# EAGLE design House_LED_Replace_WS5050 (EAGLE 9.6.2)
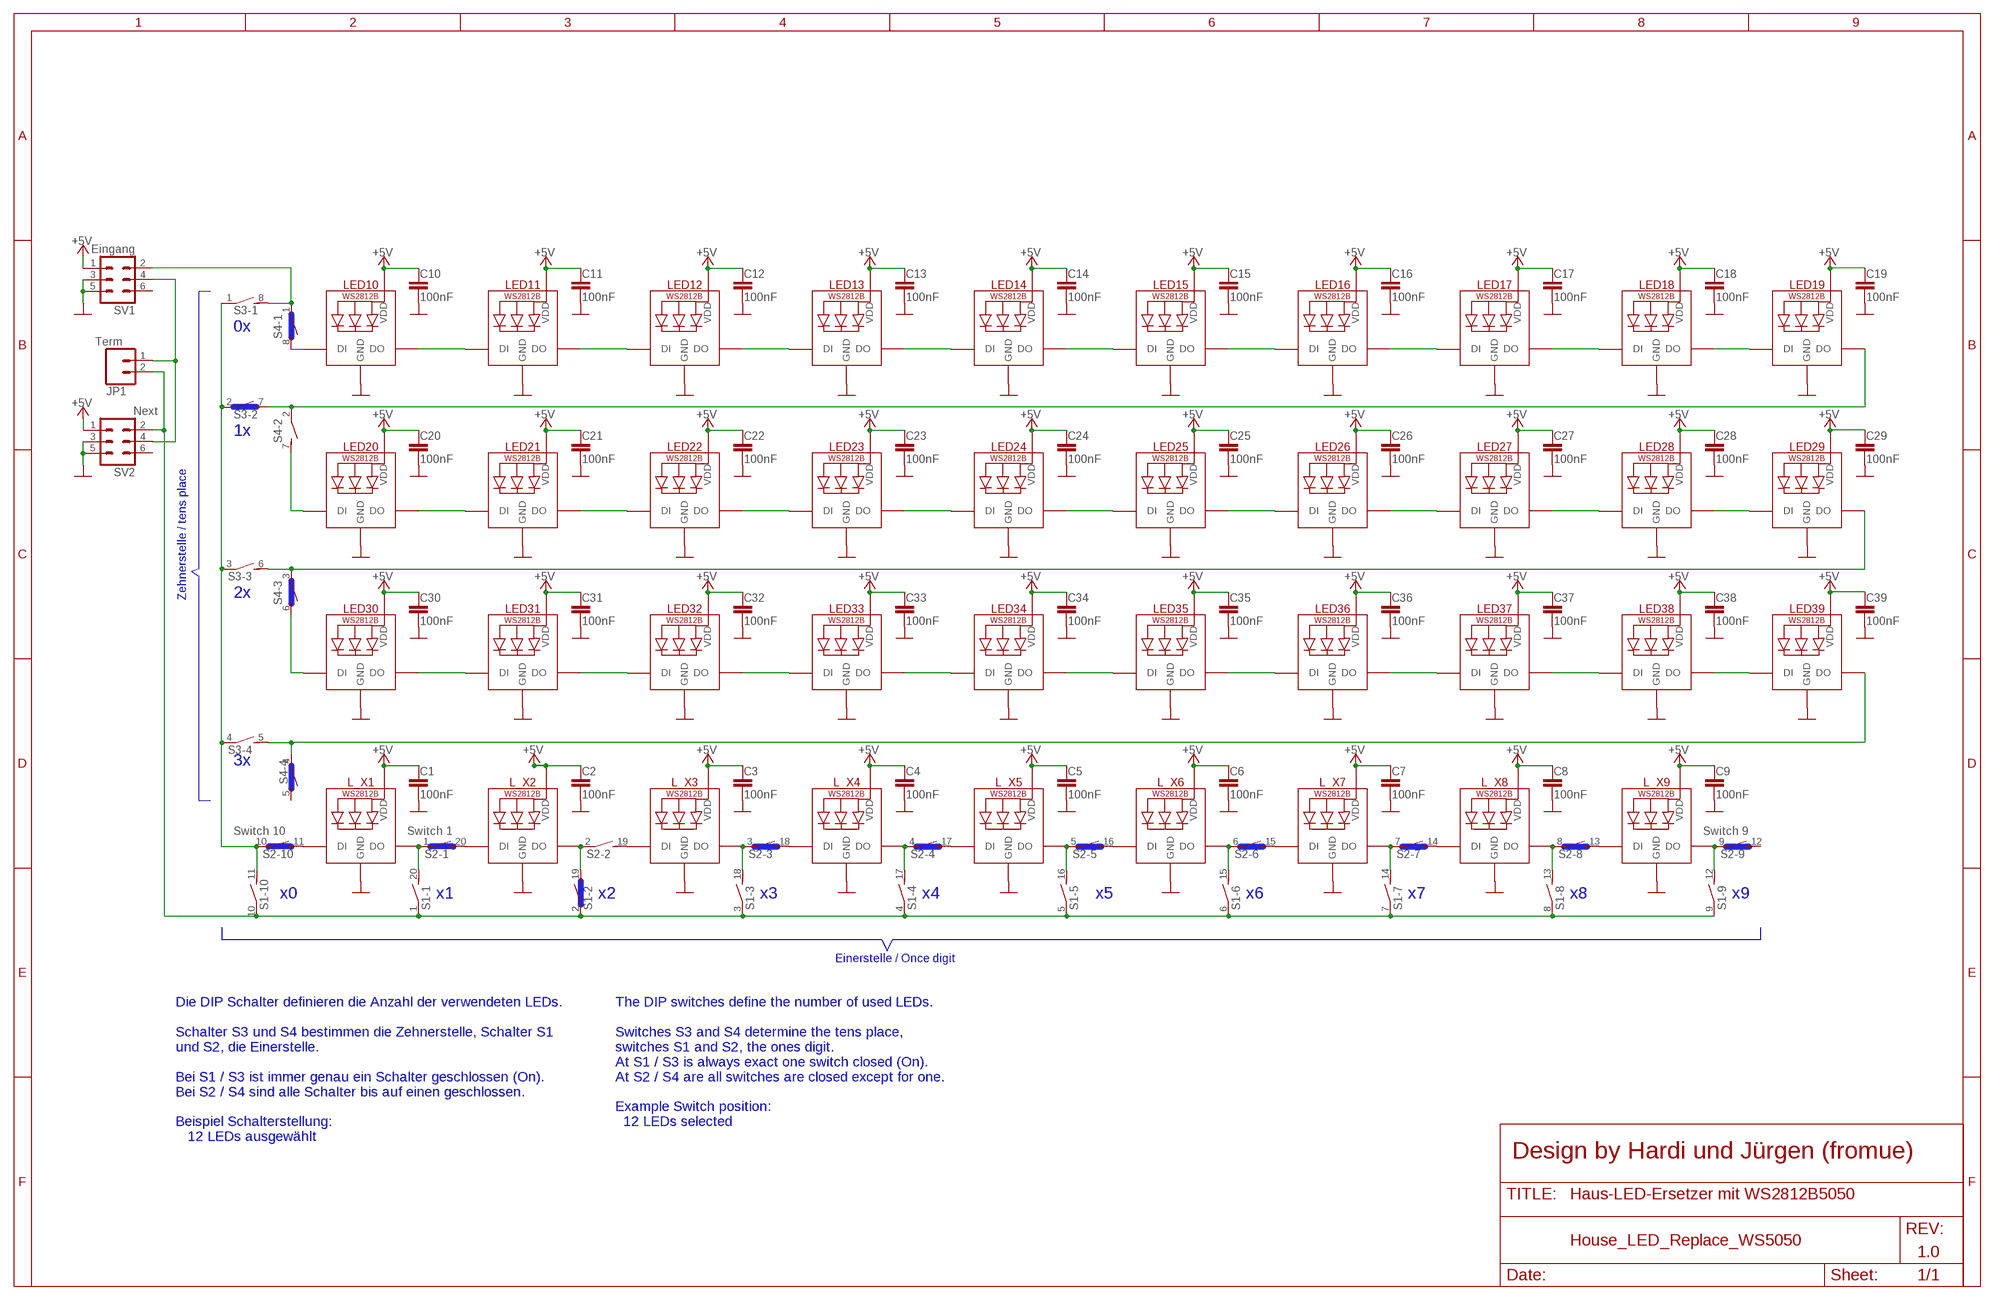
[diagram p0: schematic, sheet 1]
FRAME1 (FRAME_B_L): DATE: >LAST_DATE_TIME.; HARDI: Design by Hardi und Jürgen (fromue)

## Parts
C1  100nF  C-EUC0603  [C0603]
C2  100nF  C-EUC0603  [C0603]
C3  100nF  C-EUC0603  [C0603]
C4  100nF  C-EUC0603  [C0603]
C5  100nF  C-EUC0603  [C0603]
C6  100nF  C-EUC0603  [C0603]
C7  100nF  C-EUC0603  [C0603]
C8  100nF  C-EUC0603  [C0603]
C9  100nF  C-EUC0603  [C0603]
C10  100nF  C-EUC0603  [C0603]
C11  100nF  C-EUC0603  [C0603]
C12  100nF  C-EUC0603  [C0603]
C13  100nF  C-EUC0603  [C0603]
C14  100nF  C-EUC0603  [C0603]
C15  100nF  C-EUC0603  [C0603]
C16  100nF  C-EUC0603  [C0603]
C17  100nF  C-EUC0603  [C0603]
C18  100nF  C-EUC0603  [C0603]
C19  100nF  C-EUC0603  [C0603]
C20  100nF  C-EUC0603  [C0603]
C21  100nF  C-EUC0603  [C0603]
C22  100nF  C-EUC0603  [C0603]
C23  100nF  C-EUC0603  [C0603]
C24  100nF  C-EUC0603  [C0603]
C25  100nF  C-EUC0603  [C0603]
C26  100nF  C-EUC0603  [C0603]
C27  100nF  C-EUC0603  [C0603]
C28  100nF  C-EUC0603  [C0603]
C29  100nF  C-EUC0603  [C0603]
C30  100nF  C-EUC0603  [C0603]
C31  100nF  C-EUC0603  [C0603]
C32  100nF  C-EUC0603  [C0603]
C33  100nF  C-EUC0603  [C0603]
C34  100nF  C-EUC0603  [C0603]
C35  100nF  C-EUC0603  [C0603]
C36  100nF  C-EUC0603  [C0603]
C37  100nF  C-EUC0603  [C0603]
C38  100nF  C-EUC0603  [C0603]
C39  100nF  C-EUC0603  [C0603]
JP1  Term  M02PTH  [1X02]
L_X1  WS2812B5050  [WS2812B]
L_X2  WS2812B5050  [WS2812B]
L_X3  WS2812B5050  [WS2812B]
L_X4  WS2812B5050  [WS2812B]
L_X5  WS2812B5050  [WS2812B]
L_X6  WS2812B5050  [WS2812B]
L_X7  WS2812B5050  [WS2812B]
L_X8  WS2812B5050  [WS2812B]
L_X9  WS2812B5050  [WS2812B]
LED10  WS2812B5050  [WS2812B]
LED11  WS2812B5050  [WS2812B]
LED12  WS2812B5050  [WS2812B]
LED13  WS2812B5050  [WS2812B]
LED14  WS2812B5050  [WS2812B]
LED15  WS2812B5050  [WS2812B]
LED16  WS2812B5050  [WS2812B]
LED17  WS2812B5050  [WS2812B]
LED18  WS2812B5050  [WS2812B]
LED19  WS2812B5050  [WS2812B]
LED20  WS2812B5050  [WS2812B]
LED21  WS2812B5050  [WS2812B]
LED22  WS2812B5050  [WS2812B]
LED23  WS2812B5050  [WS2812B]
LED24  WS2812B5050  [WS2812B]
LED25  WS2812B5050  [WS2812B]
LED26  WS2812B5050  [WS2812B]
LED27  WS2812B5050  [WS2812B]
LED28  WS2812B5050  [WS2812B]
LED29  WS2812B5050  [WS2812B]
LED30  WS2812B5050  [WS2812B]
LED31  WS2812B5050  [WS2812B]
LED32  WS2812B5050  [WS2812B]
LED33  WS2812B5050  [WS2812B]
LED34  WS2812B5050  [WS2812B]
LED35  WS2812B5050  [WS2812B]
LED36  WS2812B5050  [WS2812B]
LED37  WS2812B5050  [WS2812B]
LED38  WS2812B5050  [WS2812B]
LED39  WS2812B5050  [WS2812B]
S1  DIP10SB  [DIP10SB]
S2  DIP10SB  [DIP10SB]
S3  DIP04S  [DIP04S]
S4  DIP04S  [DIP04S]
SV1  Eingang  ML6  [ML6]
SV2  Next  ML6  [ML6]

## Nets
+5V: C1.1 C2.1 C3.1 C4.1 C5.1 C6.1 C7.1 C8.1 C9.1 C10.1 C11.1 C12.1 C13.1 C14.1 C15.1 C16.1 C17.1 C18.1 C19.1 C20.1 C21.1 C22.1 C23.1 C24.1 C25.1 C26.1 C27.1 C28.1 C29.1 C30.1 C31.1 C32.1 C33.1 C34.1 C35.1 C36.1 C37.1 C38.1 C39.1 L_X1.1-5V(VDD) L_X2.1-5V(VDD) L_X3.1-5V(VDD) L_X4.1-5V(VDD) L_X5.1-5V(VDD) L_X6.1-5V(VDD) L_X7.1-5V(VDD) L_X8.1-5V(VDD) L_X9.1-5V(VDD) LED10.1-5V(VDD) LED11.1-5V(VDD) LED12.1-5V(VDD) LED13.1-5V(VDD) LED14.1-5V(VDD) LED15.1-5V(VDD) LED16.1-5V(VDD) LED17.1-5V(VDD) LED18.1-5V(VDD) LED19.1-5V(VDD) LED20.1-5V(VDD) LED21.1-5V(VDD) LED22.1-5V(VDD) LED23.1-5V(VDD) LED24.1-5V(VDD) LED25.1-5V(VDD) LED26.1-5V(VDD) LED27.1-5V(VDD) LED28.1-5V(VDD) LED29.1-5V(VDD) LED30.1-5V(VDD) LED31.1-5V(VDD) LED32.1-5V(VDD) LED33.1-5V(VDD) LED34.1-5V(VDD) LED35.1-5V(VDD) LED36.1-5V(VDD) LED37.1-5V(VDD) LED38.1-5V(VDD) LED39.1-5V(VDD) SV1.1 SV2.1
GND: C1.2 C2.2 C3.2 C4.2 C5.2 C6.2 C7.2 C8.2 C9.2 C10.2 C11.2 C12.2 C13.2 C14.2 C15.2 C16.2 C17.2 C18.2 C19.2 C20.2 C21.2 C22.2 C23.2 C24.2 C25.2 C26.2 C27.2 C28.2 C29.2 C30.2 C31.2 C32.2 C33.2 C34.2 C35.2 C36.2 C37.2 C38.2 C39.2 L_X1.3-GND(GND) L_X2.3-GND(GND) L_X3.3-GND(GND) L_X4.3-GND(GND) L_X5.3-GND(GND) L_X6.3-GND(GND) L_X7.3-GND(GND) L_X8.3-GND(GND) L_X9.3-GND(GND) LED10.3-GND(GND) LED11.3-GND(GND) LED12.3-GND(GND) LED13.3-GND(GND) LED14.3-GND(GND) LED15.3-GND(GND) LED16.3-GND(GND) LED17.3-GND(GND) LED18.3-GND(GND) LED19.3-GND(GND) LED20.3-GND(GND) LED21.3-GND(GND) LED22.3-GND(GND) LED23.3-GND(GND) LED24.3-GND(GND) LED25.3-GND(GND) LED26.3-GND(GND) LED27.3-GND(GND) LED28.3-GND(GND) LED29.3-GND(GND) LED30.3-GND(GND) LED31.3-GND(GND) LED32.3-GND(GND) LED33.3-GND(GND) LED34.3-GND(GND) LED35.3-GND(GND) LED36.3-GND(GND) LED37.3-GND(GND) LED38.3-GND(GND) LED39.3-GND(GND) SV1.3 SV1.5 SV2.3 SV2.5
N$1: JP1.2 S1.1 S1.2 S1.3 S1.4 S1.5 S1.6 S1.7 S1.8 S1.9 S1.10 SV2.2
N$2: L_X1.2-DOUT(DO) S1.20 S2.1
N$3: L_X2.4-DIN(DI) S2.20
N$4: L_X2.2-DOUT(DO) S1.19 S2.2
N$5: L_X3.4-DIN(DI) S2.19
N$6: L_X3.2-DOUT(DO) S1.18 S2.3
N$7: L_X4.4-DIN(DI) S2.18
N$8: L_X4.2-DOUT(DO) S1.17 S2.4
N$9: LED10.2-DOUT(DO) LED11.4-DIN(DI)
N$10: LED11.2-DOUT(DO) LED12.4-DIN(DI)
N$11: LED12.2-DOUT(DO) LED13.4-DIN(DI)
N$12: LED13.2-DOUT(DO) LED14.4-DIN(DI)
N$13: LED14.2-DOUT(DO) LED15.4-DIN(DI)
N$14: LED15.2-DOUT(DO) LED16.4-DIN(DI)
N$15: LED16.2-DOUT(DO) LED17.4-DIN(DI)
N$16: LED17.2-DOUT(DO) LED18.4-DIN(DI)
N$17: LED18.2-DOUT(DO) LED19.4-DIN(DI)
N$18: LED30.2-DOUT(DO) LED31.4-DIN(DI)
N$19: LED20.2-DOUT(DO) LED21.4-DIN(DI)
N$20: LED21.2-DOUT(DO) LED22.4-DIN(DI)
N$21: LED22.2-DOUT(DO) LED23.4-DIN(DI)
N$22: LED23.2-DOUT(DO) LED24.4-DIN(DI)
N$23: LED24.2-DOUT(DO) LED25.4-DIN(DI)
N$24: LED25.2-DOUT(DO) LED26.4-DIN(DI)
N$25: LED26.2-DOUT(DO) LED27.4-DIN(DI)
N$26: LED27.2-DOUT(DO) LED28.4-DIN(DI)
N$27: LED28.2-DOUT(DO) LED29.4-DIN(DI)
N$28: LED31.2-DOUT(DO) LED32.4-DIN(DI)
N$29: LED32.2-DOUT(DO) LED33.4-DIN(DI)
N$30: LED33.2-DOUT(DO) LED34.4-DIN(DI)
N$31: LED34.2-DOUT(DO) LED35.4-DIN(DI)
N$32: LED35.2-DOUT(DO) LED36.4-DIN(DI)
N$33: LED36.2-DOUT(DO) LED37.4-DIN(DI)
N$34: LED37.2-DOUT(DO) LED38.4-DIN(DI)
N$35: LED38.2-DOUT(DO) LED39.4-DIN(DI)
N$36: L_X5.4-DIN(DI) S2.17
N$37: L_X5.2-DOUT(DO) S1.16 S2.5
N$38: LED19.2-DOUT(DO) S3.7 S4.2
N$39: LED20.4-DIN(DI) S4.7
N$40: L_X6.4-DIN(DI) S2.16
N$41: LED30.4-DIN(DI) S4.6
N$42: LED39.2-DOUT(DO) S3.5 S4.4
N$43: L_X6.2-DOUT(DO) S1.15 S2.6
N$44: L_X7.4-DIN(DI) S2.15
N$45: L_X7.2-DOUT(DO) S1.14 S2.7
N$46: L_X8.4-DIN(DI) S2.14
N$47: L_X8.2-DOUT(DO) S1.13 S2.8
N$48: LED10.4-DIN(DI) S4.8
N$49: S3.8 S4.1 SV1.2
N$50: S1.11 S2.10 S3.1 S3.2 S3.3 S3.4
N$51: L_X9.4-DIN(DI) S2.13
N$52: L_X9.2-DOUT(DO) S1.12 S2.9
N$53: L_X1.4-DIN(DI) S2.11
N$54: JP1.1 SV1.4 SV2.4
N$61: LED29.2-DOUT(DO) S3.6 S4.3
Unconnected: S2.12 S4.5 SV1.6 SV2.6

## Buses
B$1

## Notes on the sheet
- 0x
- 1x
- Zehnerstelle / tens place | 2x
- 3x
- Switch 10 | Switch 1 | Switch 9
- x0 | x1 | x2 | x3 | x4 | x5 | x6 | x7 | x8 | x9
- Einerstelle / Once digit
- Die DIP Schalter definieren die Anzahl der verwendeten LEDs. 
  
  Schalter S3 und S4 bestimmen die Zehnerstelle, Schalter S1 
  und S2, die Einerstelle. 
  
  Bei S1 / S3 ist immer genau ein Schalter geschlossen (On).
  Bei S2 / S4 sind alle Schalter bis auf einen geschlossen.
  
  Beispiel Schalterstellung:
     12 LEDs ausgewählt
- The DIP switches define the number of used LEDs. 
  
  Switches S3 and S4 determine the tens place, 
  switches S1 and S2, the ones digit.
  At S1 / S3 is always exact one switch closed (On).
  At S2 / S4 are all switches are closed except for one.
  
  Example Switch position:
    12 LEDs selected
- Haus-LED-Ersetzer mit WS2812B5050
- 1.0

## Library data of the parts
C1-C39 = rcl:C-EU: CAPACITOR, European symbol
JP1 = SparkFun-Connectors:M02: Standard 2-pin 0.1" header. Use with - straight break away headers ( PRT-00116) - right angle break away headers (PRT-00553) - swiss pins (PRT-00743) - machine pins (PRT-00117) - female headers (PRT-00115) Molex polarized connector foot print use with: PRT-08233 with associated crimp pins and housings. 2.54_SCREWTERM for use with PRT-10571. 3.5mm Screw Terminal footprints for PRT-08084 5mm Screw Terminal footprints for use with PRT-08432
L_X1-L_X9 LED10-LED39 = adafruit:WS2812B
S1 S2 = switch-dil:DIP10SB: DIL/CODE SWITCH; OC_FARNELL: unknown; OC_NEWARK: unknown
S3 S4 = switch-dil:DIP04S: DIL/CODE SWITCH; OC_FARNELL: unknown; OC_NEWARK: unknown
SV1 SV2 = Arduino_fuer_LEDs_DCC_2:ML6: HARTING; OC_FARNELL: unknown; OC_NEWARK: unknown

## Board
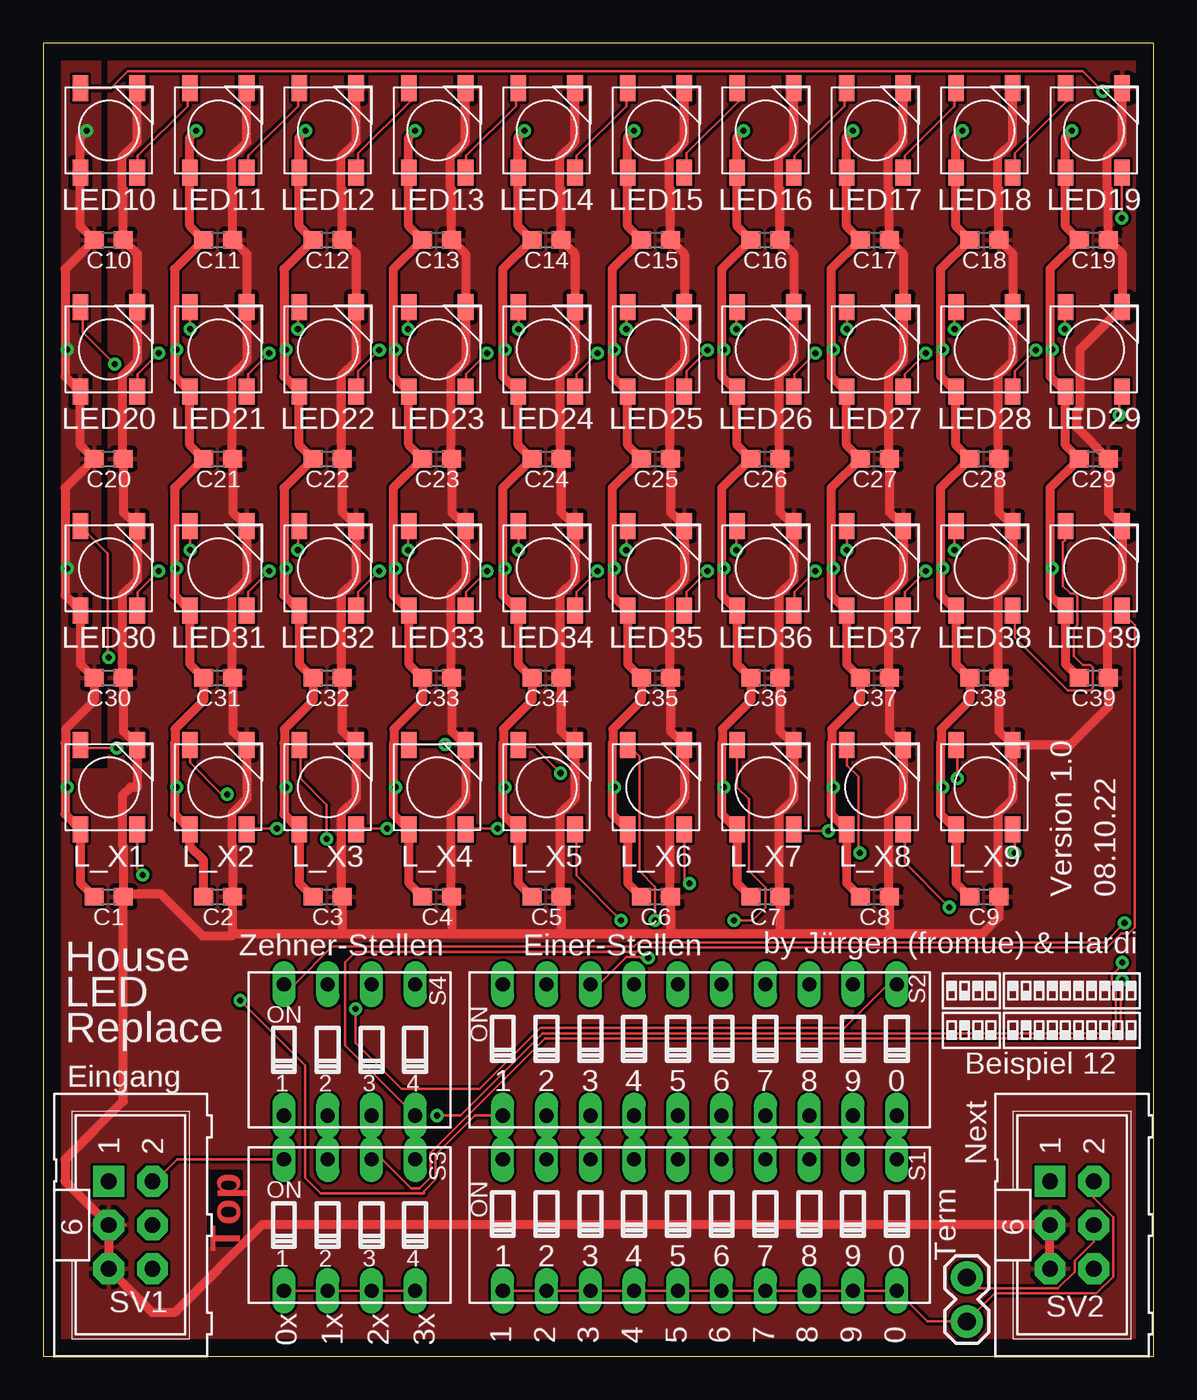
[diagram p1: board, top side]
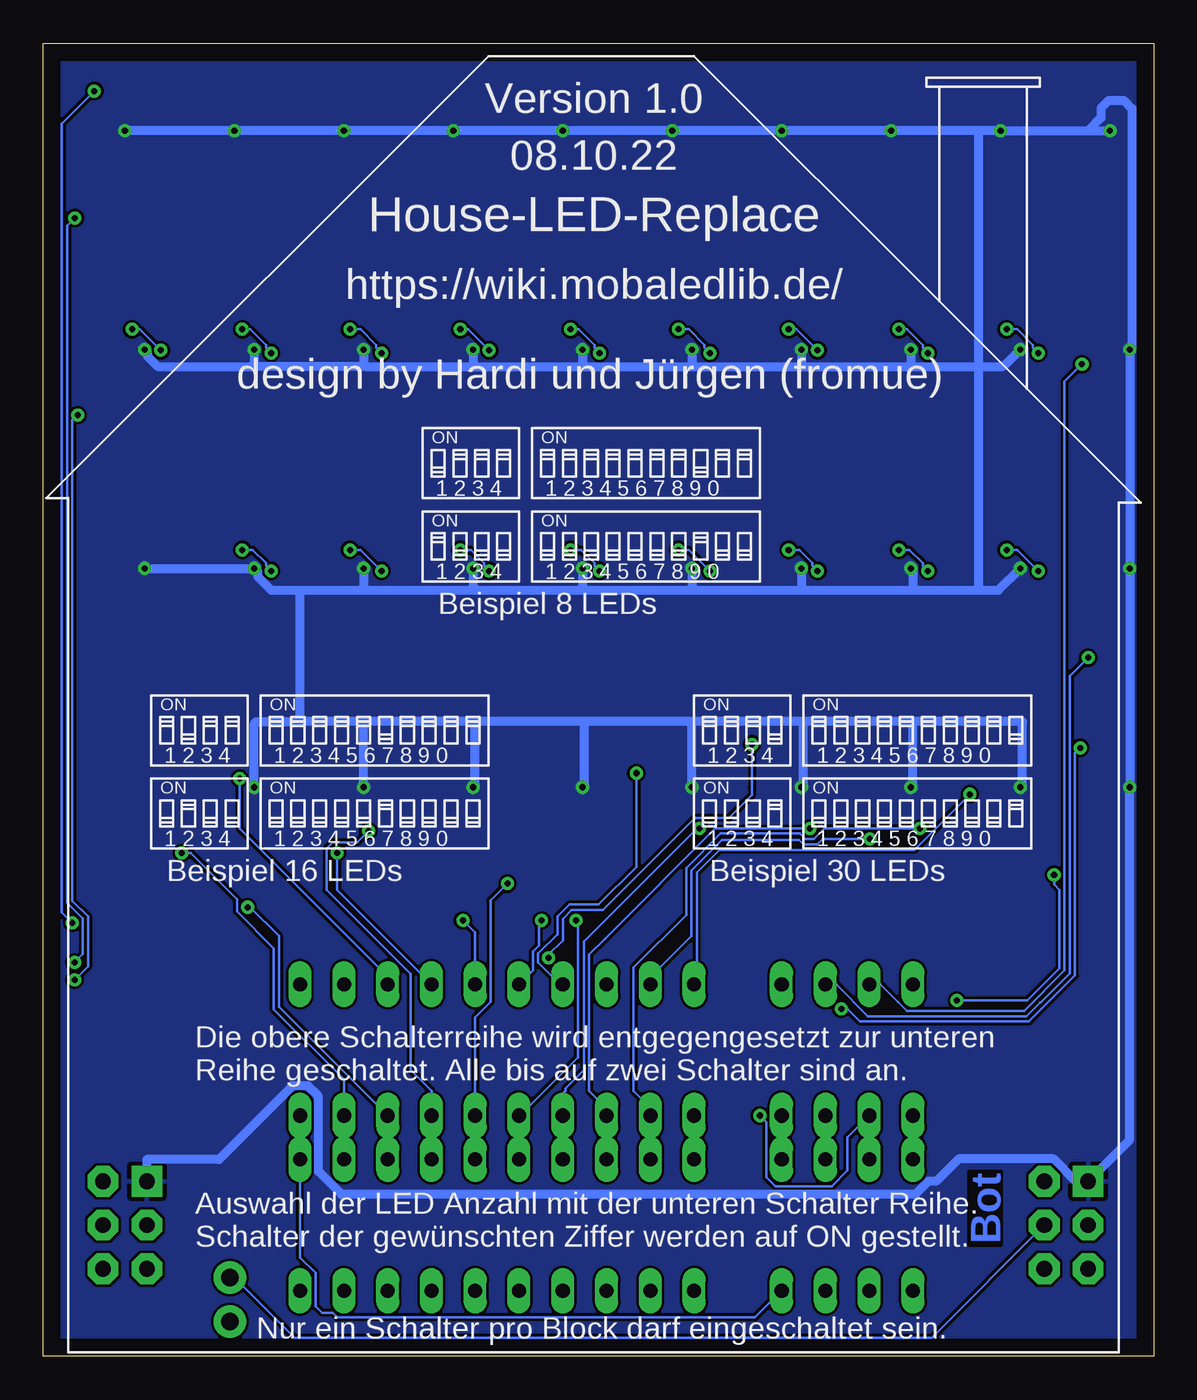
[diagram p2: board, bottom side, seen from below]

Size 64.44 x 76.19 mm. Coordinates in mm from the lower left corner, seen from the top.
Outline: 0,0 64.44,0 64.44,76.19 0,76.19 0,0
Copper layers (1*16): Top 0.035mm / dielectric 1.5mm / Bottom 0.035mm
Design rules "default *": minimum track width 6mil, minimum drill 0.35mm, track to track 6mil, track to pad 6mil, pad to pad 6mil, via to via 6mil, smd to smd 6mil, copper to edge 40mil, drill to drill 6mil, minimum pad ring 10mil, minimum via ring 8mil, stop-mask expansion 4mil, vias tented up to drill 0.5mm, thermal gap 10mil

### Footprints (pad centres in the part's own frame; a part is rotated, then mirrored left to right if it is on the bottom)
C0603 = smd 1.1 x 1: 1 -0.85,0; 2 0.85,0
1X02 = drill 1.016 pad 1.88: 1 0,0; 2 2.54,0
WS2812B = smd 1.5 x 0.9: 1-5V 2.45,-1.65; 2-DOUT 2.45,1.65; 3-GND -2.45,1.65; 4-DIN -2.45,-1.65
DIP10SB = drill 0.813 long: 1 -11.43,-3.81; 2 -8.89,-3.81; 3 -6.35,-3.81; 4 -3.81,-3.81; 5 -1.27,-3.81; 6 1.27,-3.81; 7 3.81,-3.81; 8 6.35,-3.81; 9 8.89,-3.81; 10 11.43,-3.81; 11 11.43,3.81; 12 8.89,3.81; 13 6.35,3.81; 14 3.81,3.81; 15 1.27,3.81; 16 -1.27,3.81; 17 -3.81,3.81; 18 -6.35,3.81; 19 -8.89,3.81; 20 -11.43,3.81
DIP04S = drill 0.813 long: 1 -3.81,-3.81; 2 -1.27,-3.81; 3 1.27,-3.81; 4 3.81,-3.81; 5 3.81,3.81; 6 1.27,3.81; 7 -1.27,3.81; 8 -3.81,3.81
ML6 = drill 0.914 pad 1.778 square: 1 -2.54,-1.27 | drill 0.914 pad 1.778 octagon: 2 -2.54,1.27; 3 0,-1.27; 4 0,1.27; 5 2.54,-1.27; 6 2.54,1.27

### Placement (x,y rotation side)
C1  3.81,26.67 0 top
C2  10.16,26.67 0 top
C3  16.51,26.67 0 top
C4  22.86,26.67 0 top
C5  29.21,26.67 0 top
C6  35.56,26.67 0 top
C7  41.91,26.67 0 top
C8  48.26,26.67 0 top
C9  54.61,26.67 0 top
C10  3.81,64.77 0 top
C11  10.16,64.77 0 top
C12  16.51,64.77 0 top
C13  22.86,64.77 0 top
C14  29.21,64.77 0 top
C15  35.56,64.77 0 top
C16  41.91,64.77 0 top
C17  48.26,64.77 0 top
C18  54.61,64.77 0 top
C19  60.96,64.77 0 top
C20  3.81,52.07 0 top
C21  10.16,52.07 0 top
C22  16.51,52.07 0 top
C23  22.86,52.07 0 top
C24  29.21,52.07 0 top
C25  35.56,52.07 0 top
C26  41.91,52.07 0 top
C27  48.26,52.07 0 top
C28  54.61,52.07 0 top
C29  60.96,52.07 0 top
C30  3.81,39.37 0 top
C31  10.16,39.37 0 top
C32  16.51,39.37 0 top
C33  22.86,39.37 0 top
C34  29.21,39.37 0 top
C35  35.56,39.37 0 top
C36  41.91,39.37 0 top
C37  48.26,39.37 0 top
C38  54.61,39.37 0 top
C39  60.96,39.37 0 top
JP1  53.59,4.57 270 top
L_X1  3.81,33.02 270 top
L_X2  10.16,33.02 270 top
L_X3  16.51,33.02 270 top
L_X4  22.86,33.02 270 top
L_X5  29.21,33.02 270 top
L_X6  35.56,33.02 270 top
L_X7  41.91,33.02 270 top
L_X8  48.26,33.02 270 top
L_X9  54.61,33.02 270 top
LED10  3.81,71.12 270 top
LED11  10.16,71.12 270 top
LED12  16.51,71.12 270 top
LED13  22.86,71.12 270 top
LED14  29.21,71.12 270 top
LED15  35.56,71.12 270 top
LED16  41.91,71.12 270 top
LED17  48.26,71.12 270 top
LED18  54.61,71.12 270 top
LED19  60.96,71.12 270 top
LED20  3.81,58.42 270 top
LED21  10.16,58.42 270 top
LED22  16.51,58.42 270 top
LED23  22.86,58.42 270 top
LED24  29.21,58.42 270 top
LED25  35.56,58.42 270 top
LED26  41.91,58.42 270 top
LED27  48.26,58.42 270 top
LED28  54.61,58.42 270 top
LED29  60.96,58.42 270 top
LED30  3.81,45.72 270 top
LED31  10.16,45.72 270 top
LED32  16.51,45.72 270 top
LED33  22.86,45.72 270 top
LED34  29.21,45.72 270 top
LED35  35.56,45.72 270 top
LED36  41.91,45.72 270 top
LED37  48.26,45.72 270 top
LED38  54.61,45.72 270 top
LED39  60.96,45.72 270 top
S1  38.1,7.62 0 top
S2  38.1,17.78 0 top
S3  17.78,7.62 0 top
S4  17.78,17.78 0 top
SV1  5.08,7.62 270 top
SV2  59.69,7.62 270 top

### Tracks (layer width: path | path; a pad name or v marks a point on that pad's centre or on a via)
+5V  (via drill 0.35)
  Top 0.508: v2.54,71.12 2.16,70.74 LED10.1-5V 2.16,65.57 C10.1 1.27,63.08 1.27,58.42 | 1.27,58.42 1.27,56.86 LED20.1-5V 2.16,52.87 C20.1 1.27,50.38 1.27,45.72 | 1.27,58.42 v1.39,58.42 | 1.27,45.72 1.27,44.16 LED30.1-5V 2.16,40.17 C30.1 2.96,38.05 1.3,36.39 1.3,35.59 1.27,35.56 1.27,33.02 | 1.27,45.72 v1.39,45.72 | 1.27,33.02 1.27,31.46 L_X1.1-5V 2.16,27.47 C1.1 | 1.27,33.02 v1.39,33.02 | v34.29,71.12 33.91,70.74 LED15.1-5V 33.91,65.57 C15.1 33.02,63.08 33.02,58.42 | 33.02,58.42 33.02,56.86 LED25.1-5V 33.91,52.87 C25.1 33.02,50.38 33.02,45.72 | 33.02,58.42 v33.14,58.42 | 33.02,45.72 33.02,44.16 LED35.1-5V 33.91,40.17 C35.1 34.71,38.05 33.05,36.39 33.05,35.59 33.02,35.56 33.02,33.02 | 33.02,45.72 v33.14,45.72 | 33.02,33.02 33.02,31.46 L_X6.1-5V 33.91,27.47 C6.1 | 33.02,33.02 v33.14,33.02 | v8.89,71.12 8.51,70.74 LED11.1-5V 8.51,65.57 C11.1 7.62,63.08 7.62,58.42 | 7.62,58.42 7.62,56.86 LED21.1-5V 8.51,52.87 C21.1 7.62,50.38 7.62,45.72 | 7.62,58.42 v7.74,58.42 | 7.62,45.72 7.62,44.16 LED31.1-5V 8.51,40.17 C31.1 9.31,38.05 7.65,36.39 7.65,35.59 7.62,35.56 7.62,33.02 | 7.62,45.72 v7.74,45.72 | 7.62,33.02 7.62,31.46 L_X2.1-5V 8.51,29.59 9.31,28.79 C2.1 | 7.62,33.02 v7.74,33.02 | v15.24,71.12 14.86,70.74 LED12.1-5V 14.86,65.57 C12.1 13.97,63.08 13.97,58.42 | 13.97,58.42 13.97,56.86 LED22.1-5V 14.86,52.87 C22.1 13.97,50.38 13.97,45.72 | 13.97,58.42 v14.09,58.42 | 13.97,45.72 13.97,44.16 LED32.1-5V 14.86,40.17 C32.1 15.66,38.05 14,36.39 14,35.59 13.97,35.56 13.97,33.02 | 13.97,45.72 v14.09,45.72 | 13.97,33.02 13.97,31.46 L_X3.1-5V 14.86,27.47 C3.1 | 13.97,33.02 v14.09,33.02 | v21.59,71.12 21.21,70.74 LED13.1-5V 21.21,65.57 C13.1 20.32,63.08 20.32,58.42
  Top 0.508: 20.32,58.42 20.32,56.86 LED23.1-5V 21.21,52.87 C23.1 20.32,50.38 20.32,45.72 | 20.32,58.42 v20.44,58.42 | 20.32,45.72 20.32,44.16 LED33.1-5V 21.21,40.17 C33.1 22.01,38.05 20.35,36.39 20.35,35.59 20.32,35.56 20.32,33.02 | 20.32,45.72 v20.44,45.72 | 20.32,33.02 20.32,31.46 L_X4.1-5V 21.21,27.47 C4.1 | 20.32,33.02 v20.44,33.02 | v27.94,71.12 27.56,70.74 LED14.1-5V 27.56,65.57 C14.1 26.67,63.08 26.67,58.42 | 26.67,58.42 26.67,56.86 LED24.1-5V 27.56,52.87 C24.1 26.67,50.38 26.67,45.72 | 26.67,58.42 v26.79,58.42 | 26.67,45.72 26.67,44.16 LED34.1-5V 27.56,40.17 C34.1 28.36,38.05 26.7,36.39 26.7,35.59 26.67,35.56 26.67,33.02 | 26.67,45.72 v26.79,45.72 | 26.67,33.02 26.67,31.46 L_X5.1-5V 27.56,27.47 C5.1 | 26.67,33.02 v26.79,33.02 | v40.64,71.12 40.26,70.74 LED16.1-5V 40.26,65.57 C16.1 39.37,63.08 39.37,58.42 | 39.37,58.42 39.37,56.86 LED26.1-5V 40.26,52.87 C26.1 39.37,50.38 39.37,45.72 | 39.37,58.42 v39.49,58.42 | 39.37,45.72 39.37,44.16 LED36.1-5V 40.26,40.17 C36.1 41.06,38.05 39.4,36.39 39.4,35.59 39.37,35.56 39.37,33.02 | 39.37,45.72 v39.49,45.72 | 39.37,33.02 39.37,31.46 L_X7.1-5V 40.26,27.47 C7.1 | 39.37,33.02 v39.49,33.02 | v46.99,71.12 46.61,70.74 LED17.1-5V 46.61,65.57 C17.1 45.72,63.08 45.72,58.42 | 45.72,58.42 45.72,56.86 LED27.1-5V 46.61,52.87 C27.1 45.72,50.38 45.72,45.72 | 45.72,58.42 v45.84,58.42 | 45.72,45.72 45.72,44.16 LED37.1-5V 46.61,40.17 C37.1 47.41,38.05 45.75,36.39 45.75,35.59 45.72,35.56 45.72,33.02 | 45.72,45.72 v45.84,45.72 | 45.72,33.02 45.72,31.46 L_X8.1-5V 46.61,27.47 C8.1 | 45.72,33.02 v45.84,33.02 | v53.34,71.12 52.96,70.74 LED18.1-5V 52.96,65.57 C18.1 52.07,63.08 52.07,58.42
  Top 0.508: 52.07,58.42 52.07,56.86 LED28.1-5V 52.96,52.87 C28.1 52.07,50.38 52.07,45.72 | 52.07,58.42 v52.19,58.42 | 52.07,45.72 52.07,44.16 LED38.1-5V 52.96,40.17 C38.1 53.76,38.05 52.1,36.39 52.1,35.59 52.07,35.56 52.07,33.02 | 52.07,45.72 v52.19,45.72 | 52.07,33.02 52.07,31.46 L_X9.1-5V 52.96,27.47 C9.1 | 52.07,33.02 v52.19,33.02 | v59.69,71.12 59.31,70.74 LED19.1-5V 59.31,65.57 C19.1 58.42,63.08 58.42,58.42 | 58.42,58.42 58.42,56.86 LED29.1-5V 59.31,52.87 C29.1 58.42,50.38 58.42,45.72 | 58.42,58.42 v58.54,58.42 | 58.42,45.72 58.42,44.16 LED39.1-5V 59.31,40.17 C39.1 | 58.42,45.72 v58.54,45.72
  Bottom 0.508: v7.74,58.42 8.73,57.43 10.16,57.43 | 45.72,57.43 52.07,57.43 | 45.72,57.43 39.37,57.43 | 39.37,57.43 33.02,57.43 | 33.02,57.43 26.67,57.43 | 26.67,57.43 20.32,57.43 | 20.32,57.43 13.97,57.43 | 13.97,57.43 10.16,57.43 | v14.09,58.42 14.09,57.56 13.97,57.43 | v20.44,58.42 20.44,57.56 20.32,57.43 | v26.79,58.42 26.79,57.56 26.67,57.43 | v33.14,58.42 33.14,57.56 33.02,57.43 | v39.49,58.42 39.49,57.56 39.37,57.43 | v45.84,58.42 45.84,57.56 45.72,57.43 | v52.19,58.42 52.19,57.56 52.07,57.43 | 52.07,57.43 57.78,57.43 58.39,58.04 58.39,58.27 v58.54,58.42 | v58.54,45.72 v52.19,45.72 51.99,45.52 51.99,45.24 51.2,44.45 49.53,44.45 | v7.74,45.72 9.01,44.45 10.16,44.45 | 49.53,44.45 45.72,44.45 | 45.72,44.45 39.5,44.45 | 39.5,44.45 33.02,44.45 | 33.02,44.45 26.67,44.45 | 26.67,44.45 20.32,44.45 | 20.32,44.45 13.97,44.45 | 13.97,44.45 10.16,44.45 | v14.09,45.72 13.97,45.6 13.97,44.45 | v20.44,45.72 20.44,44.57 20.32,44.45 | v26.79,45.72 26.79,44.57 26.67,44.45 | v33.14,45.72 33.14,44.57 33.02,44.45 | v39.49,45.72 39.49,44.45 39.5,44.45 | v45.84,45.72 45.84,44.57 45.72,44.45 | 10.16,44.45 10.16,57.43 | 10.16,71.12 v8.89,71.12 3.81,71.12 | 10.16,71.12 v15.24,71.12 v21.59,71.12 v27.94,71.12 v34.29,71.12 v40.64,71.12 v46.99,71.12 v53.34,71.12 v59.69,71.12 | 49.53,36.83 49.53,44.45 | v39.49,33.02 39.37,33.14 39.37,36.83 | v33.14,33.02 33.02,33.14 33.02,36.83 | v20.44,33.02 20.32,33.14 20.32,36.83 | 20.32,36.83 26.67,36.83 | 26.67,36.83 33.02,36.83 | 33.02,36.83 39.37,36.83 | 39.37,36.83 45.72,36.83 | 45.72,36.83 49.53,36.83 | v7.74,33.02 7.62,33.14 7.62,36.83 13.97,36.83 | 13.97,36.83 20.32,36.83 | v14.09,33.02 13.97,33.14 13.97,36.83
  Bottom 0.508: v26.79,33.02 26.79,36.71 26.67,36.83 | v45.84,33.02 45.84,36.71 45.72,36.83 | v52.19,33.02 52.19,36.71 52.07,36.83 49.53,36.83 | 3.81,71.12 v2.54,71.12 | 3.81,71.12 3.07,71.86 3.07,72.41 2.61,72.87 1.75,72.87 1.27,72.39 1.27,58.54 v1.39,58.42 v1.39,45.72 v1.39,33.02 1.39,12.58 SV1.1 4.52,10.16 5.81,11.46 11.32,11.46 12.62,10.16 13.07,10.16 13.83,9.4 47.13,9.4 48.46,10.73 48.46,15.07 49.09,15.7 49.97,15.7 54.24,11.43 58.42,11.43 SV2.1 | 10.16,57.43 10.16,71.12
  pour Bottom: 0,76.2 64.77,76.2 66.04,74.93 66.04,1.27 64.77,0 0,0
  pour Top: 0,76.2 3.3,76.2 3.3,34.54 0,34.54
GND
  Top 0.152: SV1.3 4.77,7.62
  Top 0.508: LED10.3-GND 5.46,70.44 4.6,69.59 4.6,67.75 4.66,67.69 C10.2 5.46,63.97 LED20.3-GND 5.46,57.74 4.6,56.89 4.6,52.13 C20.2 4.66,48.97 LED30.3-GND 5.46,45.05 4.6,44.19 4.6,39.43 C30.2 4.66,36.27 L_X1.3-GND 5.46,33.02 5.08,33.02 4.6,32.54 4.6,29.65 4.66,29.59 C1.2 | LED11.3-GND 11.81,70.44 10.95,69.59 10.95,67.75 11.01,67.69 C11.2 11.81,63.97 LED21.3-GND 11.81,57.74 10.95,56.89 10.95,52.13 C21.2 11.01,48.97 LED31.3-GND 11.81,45.05 10.95,44.19 10.95,39.43 C31.2 11.01,36.27 L_X2.3-GND 11.81,32.34 10.95,31.49 10.95,29.65 11.01,29.59 C2.2 11.01,24.55 11.05,24.51 | LED12.3-GND 18.16,70.44 17.3,69.59 17.3,67.75 17.36,67.69 C12.2 18.16,63.97 LED22.3-GND 18.16,57.74 17.3,56.89 17.3,52.13 C22.2 17.36,48.97 LED32.3-GND 18.16,45.05 17.3,44.19 17.3,39.43 C32.2 17.36,36.27 L_X3.3-GND 18.16,32.34 17.3,31.49 17.3,26.73 C3.2 17.36,24.55 17.4,24.51 | LED13.3-GND 24.51,70.44 23.65,69.59 23.65,67.75 23.71,67.69 C13.2 24.51,63.97 LED23.3-GND 24.51,57.74 23.65,56.89 23.65,52.13 C23.2 23.71,48.97 LED33.3-GND 24.51,45.05 23.65,44.19 23.65,39.43 C33.2 23.71,36.27 L_X4.3-GND 24.51,32.34 23.65,31.49 23.65,26.73 C4.2 23.71,24.6 23.62,24.51 | LED14.3-GND 30.86,70.44 30,69.59 30,67.75 30.06,67.69 C14.2 30.86,63.97 LED24.3-GND 30.86,57.74 30,56.89 30,52.13 C24.2 30.06,48.97 LED34.3-GND 30.86,45.05 30,44.19 30,39.43 C34.2 30.06,36.27 L_X5.3-GND 30.86,32.34 30,31.49 30,26.73 C5.2 30.06,24.55 30.1,24.51 | LED15.3-GND 37.21,70.44 36.35,69.59 36.35,67.75 36.41,67.69 C15.2 37.21,63.97 LED25.3-GND 37.21,57.74 36.35,56.89 36.35,52.13 C25.2 36.41,48.97 LED35.3-GND 37.21,45.05 36.35,44.19 36.35,39.43 C35.2 36.41,36.27 L_X6.3-GND 37.21,32.34 36.35,31.49 36.35,26.73 C6.2 36.41,24.55 36.45,24.51
  Top 0.508: LED16.3-GND 43.56,70.44 42.7,69.59 42.7,67.75 42.76,67.69 C16.2 43.56,63.97 LED26.3-GND 43.56,57.74 42.7,56.89 42.7,52.13 C26.2 42.76,48.97 LED36.3-GND 43.56,45.05 42.7,44.19 42.7,39.43 C36.2 42.76,36.27 L_X7.3-GND 43.56,32.34 42.7,31.49 42.7,26.73 C7.2 42.76,24.55 42.8,24.51 | LED17.3-GND 49.91,70.44 49.05,69.59 49.05,67.75 49.11,67.69 C17.2 49.91,63.97 LED27.3-GND 49.91,57.74 49.05,56.89 49.05,52.13 C27.2 49.11,48.97 LED37.3-GND 49.91,45.05 49.05,44.19 49.05,39.43 C37.2 49.11,36.27 L_X8.3-GND 49.91,32.34 49.05,31.49 49.05,26.73 C8.2 49.11,24.55 49.15,24.51 | LED18.3-GND 56.26,70.44 55.4,69.59 55.4,67.75 55.46,67.69 C18.2 56.26,63.97 LED28.3-GND 56.26,57.74 55.4,56.89 55.4,52.13 C28.2 55.46,48.97 LED38.3-GND 56.26,45.05 55.4,44.19 55.4,39.43 C38.2 55.46,36.27 L_X9.3-GND | L_X9.3-GND 56.26,32.34 55.4,31.49 55.4,26.73 C9.2 55.46,25.49 54.48,24.51 49.15,24.51 | LED19.3-GND 62.61,70.44 61.75,69.59 61.75,67.75 61.81,67.69 C19.2 62.61,63.97 LED29.3-GND 60.17,58.43 60.17,55.05 59.97,54.86 59.97,53.91 C29.2 61.81,48.97 LED39.3-GND 62.61,45.05 61.75,44.19 61.75,39.43 C39.2 61.81,37.68 59.6,35.47 L_X9.3-GND | 49.15,24.51 42.8,24.51 | 42.8,24.51 36.45,24.51 | 36.45,24.51 30.1,24.51 | 30.1,24.51 23.62,24.51 | 23.62,24.51 17.4,24.51 | 17.4,24.51 11.05,24.51 | 11.05,24.51 10.92,24.38 9.27,24.38 6.83,26.82 4.81,26.82 C1.2 | C1.2 4.66,14.82 1.27,11.43 1.27,10.16 SV1.3 SV1.5 6.35,2.54 7.62,2.54 12.7,7.62 SV2.3 SV2.5
  pour Top: 3.81,76.2 64.52,76.2 64.52,0 0,0 0,34.04 3.81,34.04
N$1
  Top 0.152: S1.1 S1.2 S1.3 S1.4 S1.5 S1.6 S1.7 S1.8 S1.9 S1.10 51.31,2.03 JP1.2 55.22,3.66 61.12,3.66 62.08,4.62 62.08,8.08 60.96,9.2 SV2.2
N$2  (via drill 0.35)
  Top 0.152: S1.20 S2.1 25.07,13.97 22.78,11.68 22.78,10.28 22.1,9.59 22.1,9.45 16.1,9.45 15.19,10.36 15.19,16.89 v11.43,20.65 | L_X1.2-DOUT 5.46,28.27 v5.79,27.94
  Bottom 0.152: v5.79,27.94 5.79,27.38 5.48,27.07 5.48,22.51 7.34,20.65 v11.43,20.65
N$3  (via drill 0.35)
  Top 0.152: v10.67,32.61 10.36,32.61 8.53,34.44 8.53,35.36 L_X2.4-DIN
  Bottom 0.152: v10.67,32.61 13.89,29.39 25.2,29.39 26.52,28.07 26.52,21.74 S2.20
N$4  (via drill 0.35)
  Top 0.152: v13.56,30.63 11.89,30.63 L_X2.2-DOUT | S1.19 29.26,11.43 29.26,13.87 S2.2
  Bottom 0.152: v13.56,30.63 19.11,30.63 19.71,30.03 20.22,30.03 20.52,30.33 25.15,30.33 27.13,28.35 27.13,25.6 30.18,22.55 30.18,15.39 29.26,14.48 29.26,14.02 S2.2
N$5  (via drill 0.35)
  Top 0.152: v16.46,30.02 16.46,32 14.94,33.53 14.94,35.36 L_X3.4-DIN
  Bottom 0.152: v16.46,30.02 19.2,30.02 19.53,29.69 20.31,29.69 20.58,29.96 25.05,29.96 26.82,28.19 26.82,27.94 26.82,24.38 29.11,22.1 29.11,21.64 S2.19
N$6  (via drill 0.35)
  Top 0.152: v19.96,30.63 18.29,30.63 L_X3.2-DOUT | S1.18 31.85,11.43 31.85,13.87 S2.3
  Bottom 0.152: v19.96,30.63 25.45,30.63 31.85,24.23 32.77,23.32 32.77,15.39 31.85,14.48 31.85,14.02 S2.3
N$7  (via drill 0.35)
  Top 0.152: v23.32,35.51 21.34,35.51 L_X4.4-DIN | S2.18 31.85,21.64 32.31,21.64 33.83,23.16 34.63,23.16 34.68,23.12 v35.11,23.12
  Bottom 0.152: v23.32,35.51 23.32,33.02 23.32,32.56 24.64,31.24 26.62,31.24 31.95,25.91 33.78,25.91 34.29,25.39 34.29,24.13 35.11,23.31 v35.11,23.12
N$8  (via drill 0.35)
  Top 0.152: v26.36,30.63 24.54,30.63 L_X4.2-DOUT | S2.4 S1.17
  Bottom 0.152: S2.4 34.29,15.24 34.14,15.39 34.14,15.54 33.07,16.61 33.07,24.08 26.52,30.63 v26.36,30.63
N$9
  Top 0.152: LED10.2-DOUT 5.49,68.73 5.49,69.65 8.38,72.54 8.38,73.46 LED11.4-DIN
N$10
  Top 0.152: LED11.2-DOUT 11.89,68.73 11.89,69.65 14.78,72.54 14.78,73.46 LED12.4-DIN
N$11
  Top 0.152: LED12.2-DOUT 18.29,68.73 18.29,69.8 21.34,72.85 21.34,73.46 LED13.4-DIN
N$12
  Top 0.152: LED13.2-DOUT 24.54,68.73 24.54,69.65 27.43,72.54 27.43,73.46 LED14.4-DIN
N$13
  Top 0.152: LED14.2-DOUT 30.94,68.73 30.94,69.65 33.83,72.54 33.83,73.46 LED15.4-DIN
N$14
  Top 0.152: LED15.2-DOUT 37.34,68.73 37.34,69.8 40.39,72.85 40.39,73.46 LED16.4-DIN
N$15
  Top 0.152: LED16.2-DOUT 43.59,68.73 43.59,69.65 46.48,72.54 46.48,73.46 LED17.4-DIN
N$16
  Top 0.152: LED17.2-DOUT 49.99,68.73 49.99,69.65 52.88,72.54 52.88,73.46 LED18.4-DIN
N$17
  Top 0.152: LED18.2-DOUT 56.39,68.73 56.39,69.8 59.44,72.85 59.44,73.46 LED19.4-DIN
N$18  (via drill 0.35)
  Top 0.152: v6.71,45.57 5.49,44.35 5.49,43.28 LED30.2-DOUT | v8.53,46.79 8.53,48.16 LED31.4-DIN
  Bottom 0.152: v6.71,45.57 7.92,46.79 v8.53,46.79
N$19  (via drill 0.35)
  Top 0.152: v6.71,58.22 5.49,57 5.49,56.08 LED20.2-DOUT | v8.53,59.59 8.53,60.81 LED21.4-DIN
  Bottom 0.152: v6.71,58.22 7.01,58.52 7.01,58.67 7.92,59.59 v8.53,59.59
N$20  (via drill 0.35)
  Top 0.152: v13.11,58.22 11.89,57 11.89,56.08 LED21.2-DOUT | v14.78,59.59 14.78,60.81 LED22.4-DIN
  Bottom 0.152: v13.11,58.22 13.41,58.52 13.41,58.67 14.33,59.59 v14.78,59.59
N$21  (via drill 0.35)
  Top 0.152: v19.51,58.37 18.29,57.15 18.29,56.08 LED22.2-DOUT | v21.18,59.59 21.18,60.81 LED23.4-DIN
  Bottom 0.152: v19.51,58.37 20.73,59.59 v21.18,59.59
N$22  (via drill 0.35)
  Top 0.152: v25.76,58.22 24.54,57 24.54,56.08 LED23.2-DOUT | v27.58,59.59 27.58,60.81 LED24.4-DIN
  Bottom 0.152: v25.76,58.22 26.06,58.52 26.06,58.67 26.98,59.59 v27.58,59.59
N$23  (via drill 0.35)
  Top 0.152: v32.16,58.22 30.94,57 30.94,56.08 LED24.2-DOUT | v33.83,59.59 33.83,60.81 LED25.4-DIN
  Bottom 0.152: v32.16,58.22 32.46,58.52 32.46,58.67 33.38,59.59 v33.83,59.59
N$24  (via drill 0.35)
  Top 0.152: v38.56,58.37 37.34,57.15 37.34,56.08 LED25.2-DOUT | v40.23,59.59 40.23,60.81 LED26.4-DIN
  Bottom 0.152: v38.56,58.37 39.78,59.59 v40.23,59.59
N$25  (via drill 0.35)
  Top 0.152: v44.81,58.22 43.59,57 43.59,56.08 LED26.2-DOUT | v46.63,59.59 46.63,60.81 LED27.4-DIN
  Bottom 0.152: v44.81,58.22 45.11,58.52 45.11,58.67 46.02,59.59 v46.63,59.59
N$26  (via drill 0.35)
  Top 0.152: v51.21,58.22 49.99,57 49.99,56.08 LED27.2-DOUT | v52.88,59.59 52.88,60.81 LED28.4-DIN
  Bottom 0.152: v51.21,58.22 51.51,58.52 51.51,58.67 52.43,59.59 v52.88,59.59
N$27  (via drill 0.35)
  Top 0.152: v57.61,58.37 56.39,57.15 56.39,56.08 LED28.2-DOUT | v59.28,59.59 59.28,60.81 LED29.4-DIN
  Bottom 0.152: v57.61,58.37 58.83,59.59 v59.28,59.59
N$28  (via drill 0.35)
  Top 0.152: v13.11,45.57 11.89,44.35 11.89,43.28 LED31.2-DOUT | v14.78,46.79 14.78,48.16 LED32.4-DIN
  Bottom 0.152: v13.11,45.57 13.41,45.87 13.41,46.02 14.17,46.79 v14.78,46.79
N$29  (via drill 0.35)
  Top 0.152: v19.51,45.57 18.29,44.35 18.29,43.28 LED32.2-DOUT | v21.18,46.79 21.18,48.16 LED33.4-DIN
  Bottom 0.152: v19.51,45.57 19.81,45.87 19.81,46.02 20.57,46.79 v21.18,46.79
N$30  (via drill 0.35)
  Top 0.152: v25.76,45.57 24.54,44.35 24.54,43.28 LED33.2-DOUT | v27.58,46.79 27.58,48.16 LED34.4-DIN
  Bottom 0.152: v25.76,45.57 26.98,46.79 v27.58,46.79
N$31  (via drill 0.35)
  Top 0.152: v32.16,45.57 30.94,44.35 30.94,43.28 LED34.2-DOUT | v33.83,46.79 33.83,48.16 LED35.4-DIN
  Bottom 0.152: v32.16,45.57 32.46,45.87 32.46,46.02 33.22,46.79 v33.83,46.79
N$32  (via drill 0.35)
  Top 0.152: v38.56,45.57 37.34,44.35 37.34,43.28 LED35.2-DOUT | v40.23,46.79 40.23,48.16 LED36.4-DIN
  Bottom 0.152: v38.56,45.57 38.86,45.87 38.86,46.02 39.62,46.79 v40.23,46.79
N$33  (via drill 0.35)
  Top 0.152: v44.81,45.57 43.59,44.35 43.59,43.28 LED36.2-DOUT | v46.63,46.79 46.63,48.16 LED37.4-DIN
  Bottom 0.152: v44.81,45.57 46.02,46.79 v46.63,46.79
N$34  (via drill 0.35)
  Top 0.152: v51.21,45.57 49.99,44.35 49.99,43.28 LED37.2-DOUT | v52.88,46.79 52.88,48.16 LED38.4-DIN
  Bottom 0.152: v51.21,45.57 51.51,45.87 51.51,46.02 52.27,46.79 v52.88,46.79
N$35
  Top 0.152: LED38.2-DOUT 56.39,43.13 56.39,41.72 59.47,38.64 60.76,38.64 60.89,38.77 60.89,39.97 60.76,40.1 60.33,40.1 59.79,40.64 59.79,42.23 59.99,42.42 59.99,44.12 59.85,44.25 59.61,44.25 59.17,44.69 59.17,47.23 59.31,47.37 LED39.4-DIN
N$36  (via drill 0.35)
  Top 0.152: v30.02,33.83 28.5,35.36 27.58,35.36 L_X5.4-DIN
  Bottom 0.152: v30.02,33.83 30.02,28.4 32.21,26.21 33.91,26.21 34.59,25.52 34.59,24.49 35.72,23.37 35.72,22.86 34.44,21.59 S2.17
N$37  (via drill 0.35)
  Top 0.152: L_X5.2-DOUT 30.94,30.48 30.94,27.89 v33.53,25.3 | S1.16 36.88,11.43 36.88,13.87 S2.5
  Bottom 0.152: S2.5 36.73,14.02 33.4,17.35 33.4,25.17 v33.53,25.3
N$38  (via drill 0.35)
  Top 0.152: S3.7 16.56,11.43 16.56,13.87 S4.2 | v62.59,66.04 62.59,68.66 LED19.2-DOUT | v62.61,22.86 62.61,22.7 62,22.09 62,21.59 62.23,21.37 62.23,19.05 61.92,18.75 28.98,18.75 24.21,13.97 v22.86,13.97
  Bottom 0.152: v62.59,66.04 63.04,65.59 63.04,26.3 62.13,25.39 62.13,23.34 v62.61,22.86 | S4.2 17.78,12.7 17.78,10.78 18.68,9.88 21.96,9.88 22.48,10.4 22.48,13.59 v22.86,13.97
N$39  (via drill 0.35)
  Top 0.152: LED20.4-DIN 2.29,60.81 2.29,59.44 v4.16,57.56
  Bottom 0.152: v4.16,57.56 5.18,56.54 5.18,22.38 7.52,20.04 14.34,20.04 14.86,20.56 14.86,20.57 15.88,21.59 S4.7
N$40  (via drill 0.35)
  Top 0.152: L_X6.4-DIN 34.59,34.79 34.59,28.16 35.51,27.24 v35.51,25.3
  Bottom 0.152: v35.51,25.3 35.66,25.3 35.66,23.85 36.02,23.49 36.02,22.4 S2.16
N$41  (via drill 0.35)
  Top 0.152: v3.81,40.54 3.76,40.59 3.76,46.57 LED30.4-DIN
  Bottom 0.152: S4.6 18.43,21.59 16.57,19.74 7.39,19.74 6.59,20.54 6.57,20.54 4.87,22.23 4.87,39.47 v3.81,40.54
N$42
  Top 0.152: LED39.2-DOUT 62.64,43.13 63.35,42.42 63.35,24.89 62.99,24.54 62.56,24.54 61.75,23.72 34.67,23.72 34.42,23.47 18.14,23.47 17.53,22.86 17.53,18.03 S4.4 S3.5
N$43  (via drill 0.35)
  Top 0.152: S1.15 39.47,11.43 39.47,13.87 S2.6 | v37.49,27.43 37.21,27.71 L_X6.2-DOUT
  Bottom 0.152: S2.6 39.37,19.67 38.48,20.56 38.48,26.44 v37.49,27.43
N$44  (via drill 0.35)
  Top 0.152: v40.08,25.3 41.15,25.3 41.91,26.06 41.91,27.19 40.94,28.16 40.94,32.34 40.26,33.02 L_X7.4-DIN
  Bottom 0.152: S2.15 39.37,24.59 v40.08,25.3
N$45  (via drill 0.35)
  Top 0.152: S2.7 S1.14 | v45.57,30.48 43.59,30.48 L_X7.2-DOUT
  Bottom 0.152: S2.7 41.91,15.39 43.13,16.61 43.13,22.19 48,27.06 48,29.46 47.65,29.82 46.23,29.82 v45.57,30.48
N$46  (via drill 0.35)
  Top 0.152: L_X8.4-DIN 46.63,35.36 46.63,34.29 47.29,33.64 47.29,29.32 v47.4,29.21
  Bottom 0.152: v47.4,29.21 47.4,27.07 S2.14
N$47  (via drill 0.35)
  Top 0.152: v52.58,26.06 49.99,28.65 49.99,30.48 L_X8.2-DOUT | S1.13 44.5,11.43 44.5,13.87 S2.8
  Bottom 0.152: v52.58,26.06 52.43,26.06 50.75,24.38 50.75,20.27 S2.8
N$48  (via drill 0.35)
  Top 0.152: S4.8 14.59,21.59 16.78,23.77 34.29,23.77 34.54,24.03 61.63,24.03 v62.74,25.14 | LED10.4-DIN 3.94,73.57 4.92,74.55 60.33,74.55 v61.47,73.41
  Bottom 0.152: v61.47,73.41 63.35,71.53 63.35,25.75 v62.74,25.14
N$49
  Top 0.152: S4.1 S3.8 7.77,11.43 6.4,10.06 SV1.2
N$50
  Top 0.152: S3.1 S3.2 S3.3 S3.4 | S2.10 S1.11
  Bottom 0.152: S3.4 23.14,2.26 47.36,2.26 47.64,2.54 48.26,2.54 48.64,2.92 48.64,4.84 49.53,5.73 S1.11
N$51  (via drill 0.35)
  Top 0.152: v53.03,33.53 53.03,35.36 L_X9.4-DIN
  Bottom 0.152: S2.13 44.5,21.64 44.5,22.1 53.03,30.63 v53.03,33.53
N$52  (via drill 0.35)
  Top 0.152: v56.39,29.21 56.39,30.48 L_X9.2-DOUT | S1.12 47.09,11.43 47.09,13.87 S2.9
  Bottom 0.152: S2.9 46.99,16.08 51.05,20.14 51.05,23.68 53.19,25.81 53.19,26.52 55.88,29.21 v56.39,29.21
N$53  (via drill 0.35)
  Top 0.152: L_X1.4-DIN 2.32,35.31 v4.27,35.31 | S2.11 49.53,21.49 48.92,21.49 46.48,19.05 28.86,19.05 25.32,15.52 20.8,15.52 18.13,18.19 v18.13,20.16
  Bottom 0.152: v4.27,35.31 4.57,35 4.57,22.1 7.24,19.43 17.05,19.43 17.78,20.16 v18.13,20.16
N$54
  Top 0.152: SV2.4 60.96,6.66 59.84,5.54 59.84,4.92 58.88,3.96 54.2,3.96 JP1.1
  Bottom 0.152: SV1.4 12.88,1.09 49.86,1.09 53.34,4.57 JP1.1
N$61  (via drill 0.35)
  Top 0.152: S4.3 19.15,13.87 19.15,11.43 S3.6 19.66,11.43 21.34,9.75 21.83,9.75 22.48,10.4 22.48,11.81 29.11,18.44 62.23,18.44 62.23,18.62 62.53,18.92 62.53,21.77 v62.61,21.84 | v62.44,54.61 62.44,55.8 LED29.2-DOUT
  Bottom 0.152: v62.44,54.61 62.74,54.31 62.74,26.43 61.83,25.52 61.83,22.63 v62.61,21.84

### Text on the board
Top: Top
Bottom: Bot
tPlace: Beispiel 12
bPlace: ON | ON | 1 2 3 4 5 6 7 8 9 0 | 1 2 3 4 | ON | ON | 1 2 3 4 5 6 7 8 9 0 | 1 2 3 4 | Beispiel 8 LEDs | ON | ON | ON | ON | 1 2 3 4 5 6 7 8 9 0 | 1 2 3 4 | 1 2 3 4 5 6 7 8 9 0 | 1 2 3 4 | ON | ON | ON | ON | 1 2 3 4 5 6 7 8 9 0 | 1 2 3 4 | 1 2 3 4 5 6 7 8 9 0 | 1 2 3 4 | Beispiel 30 LEDs | Beispiel 16 LEDs
tNames: Zehner-Stellen | Einer-Stellen | House / LED / Replace | by Jürgen (fromue) & Hardi | 0x / / 1x / / 2x / / 3x | 1 / 2 / 3 / 4 / 5 / 6 / 7 / 8 / 9 / 0
bNames: House-LED-Replace | https://wiki.mobaledlib.de/ | design by Hardi und Jürgen (fromue) | Die obere Schalterreihe wird entgegengesetzt zur unteren / Reihe geschaltet. Alle bis auf zwei Schalter sind an. | Auswahl der LED Anzahl mit der unteren Schalter Reihe. / Schalter der gewünschten Ziffer werden auf ON gestellt. | Nur ein Schalter pro Block darf eingeschaltet sein.